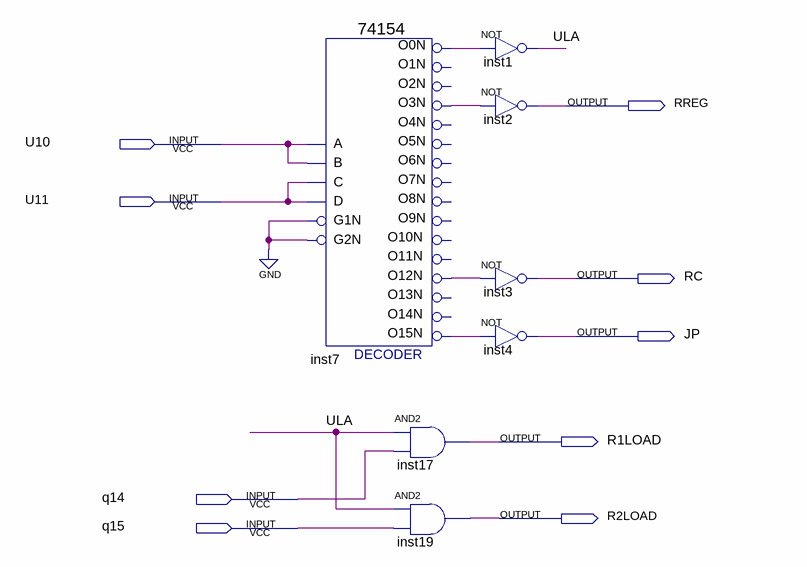
[diagram p0: schematic sheet]
// Quartus schematic CONTROLE.bdf as structural Verilog: 7 symbols, 9 pins
module CONTROLE (
  input  U10,
  input  U11,
  input  q14,
  input  q15,
  output RREG,
  output RC,
  output JP,
  output R1LOAD,
  output R2LOAD
);

  wire inst7_o0n, inst7_o3n, inst7_o12n, inst7_o15n, ULA;

  \74154  inst7 (
    .C(U11), .D(U11), .B(U10), .A(U10), .G1N(1'b0), .G2N(1'b0), .O0N(inst7_o0n), .O12N(inst7_o12n),
    .O15N(inst7_o15n), .O3N(inst7_o3n));  // open: O10N, O11N, O1N, O13N, O14N, O4N, O2N, O7N, O6N, O5N, O9N, O8N
  and inst17 (R1LOAD, ULA, q14);
  and inst19 (R2LOAD, ULA, q15);
  not inst1 (ULA, inst7_o0n);
  not inst2 (RREG, inst7_o3n);
  not inst3 (RC, inst7_o12n);
  not inst4 (JP, inst7_o15n);
endmodule
